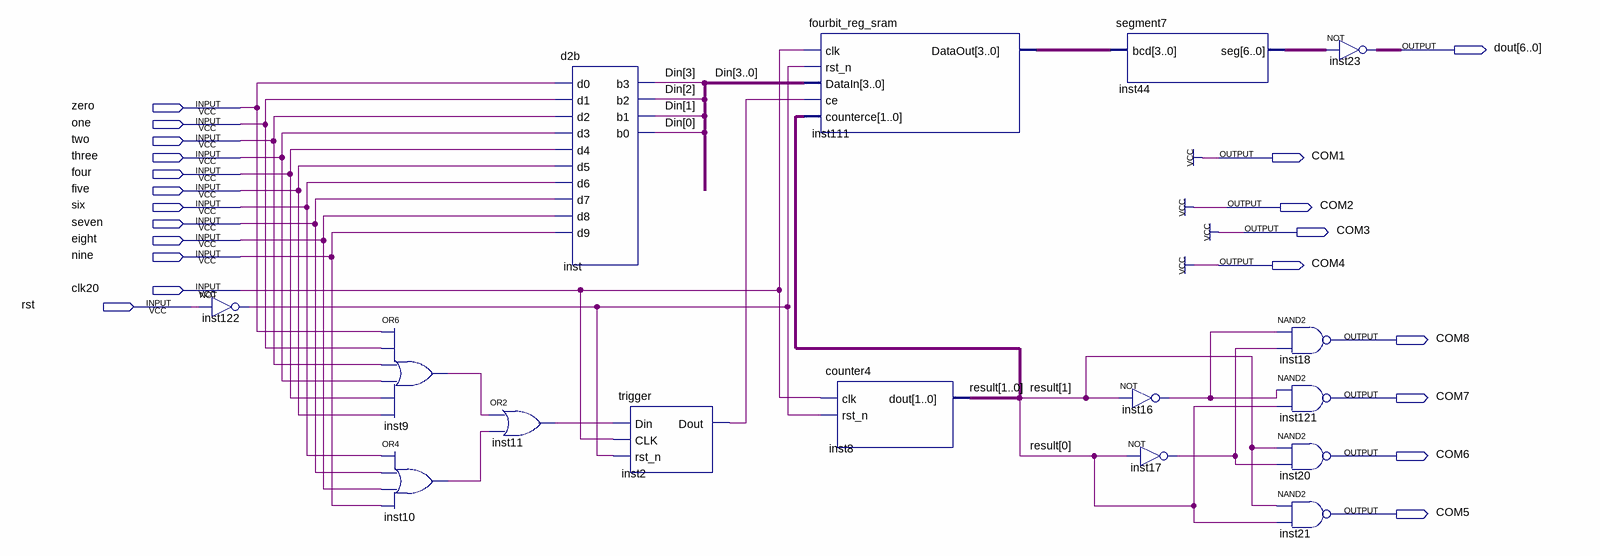
[diagram p0: schematic sheet]
// Quartus schematic assignment10_2.bdf as structural Verilog: 16 symbols, 21 pins
module assignment10_2 (
  input  zero,
  input  one,
  input  two,
  input  three,
  input  four,
  input  five,
  input  six,
  input  seven,
  input  eight,
  input  nine,
  input  clk20,
  input  rst,
  output [6:0] dout,
  output COM1,
  output COM2,
  output COM3,
  output COM4,
  output COM8,
  output COM7,
  output COM6,
  output COM5
);

  wire inst2_dout, inst9_out, inst10_out, inst11_out, inst16_out, inst17_out, inst122_out;
  wire [1:0] result;
  wire [3:0] Din, inst111_dataout;
  wire [6:0] inst44_seg;

  not inst122 (inst122_out, rst);
  or inst9 (inst9_out, zero, one, two, three, four, five);
  or inst10 (inst10_out, six, seven, eight, nine);
  or inst11 (inst11_out, inst9_out, inst10_out);
  d2b inst (
    .d0(zero), .d1(one), .d2(two), .d3(three), .d4(four), .d5(five), .d6(six), .d7(seven), .d8(eight),
    .d9(nine), .b3(Din[3]), .b2(Din[2]), .b1(Din[1]), .b0(Din[0]));
  trigger inst2 (.Din(inst11_out), .CLK(clk20), .rst_n(inst122_out), .Dout(inst2_dout));
  fourbit_reg_sram inst111 (
    .clk(clk20), .rst_n(inst122_out), .DataIn(Din), .ce(inst2_dout), .counterce(result),
    .DataOut(inst111_dataout));
  counter4 inst8 (.clk(clk20), .rst_n(inst122_out), .dout(result));
  segment7 inst44 (.bcd(inst111_dataout), .seg(inst44_seg));
  not inst16 (inst16_out, result[1]);
  not inst17 (inst17_out, result[0]);
  nand inst18 (COM8, inst16_out, inst17_out);
  nand inst121 (COM7, inst16_out, result[0]);
  nand inst20 (COM6, result[1], inst17_out);
  nand inst21 (COM5, result[1], result[0]);
  assign dout = ~inst44_seg;  // NOT inst23, 7 bits wide

  assign COM1 = 1'b1;
  assign COM2 = 1'b1;
  assign COM3 = 1'b1;
  assign COM4 = 1'b1;
endmodule
